# Altium schematic sheet sb-sonata-fpganaalog.SchDoc: FPGA Analog + 1.8V Bank
size Letter; Organization: NewAE Technology Inc.; Address1: 1083 Queen St., Suite 196; Address2: Halifax; Address3: NS; Address4: Canada B3H 0B2; SheetNumber: 15; SheetTotal: 19; SheetApproved: NO
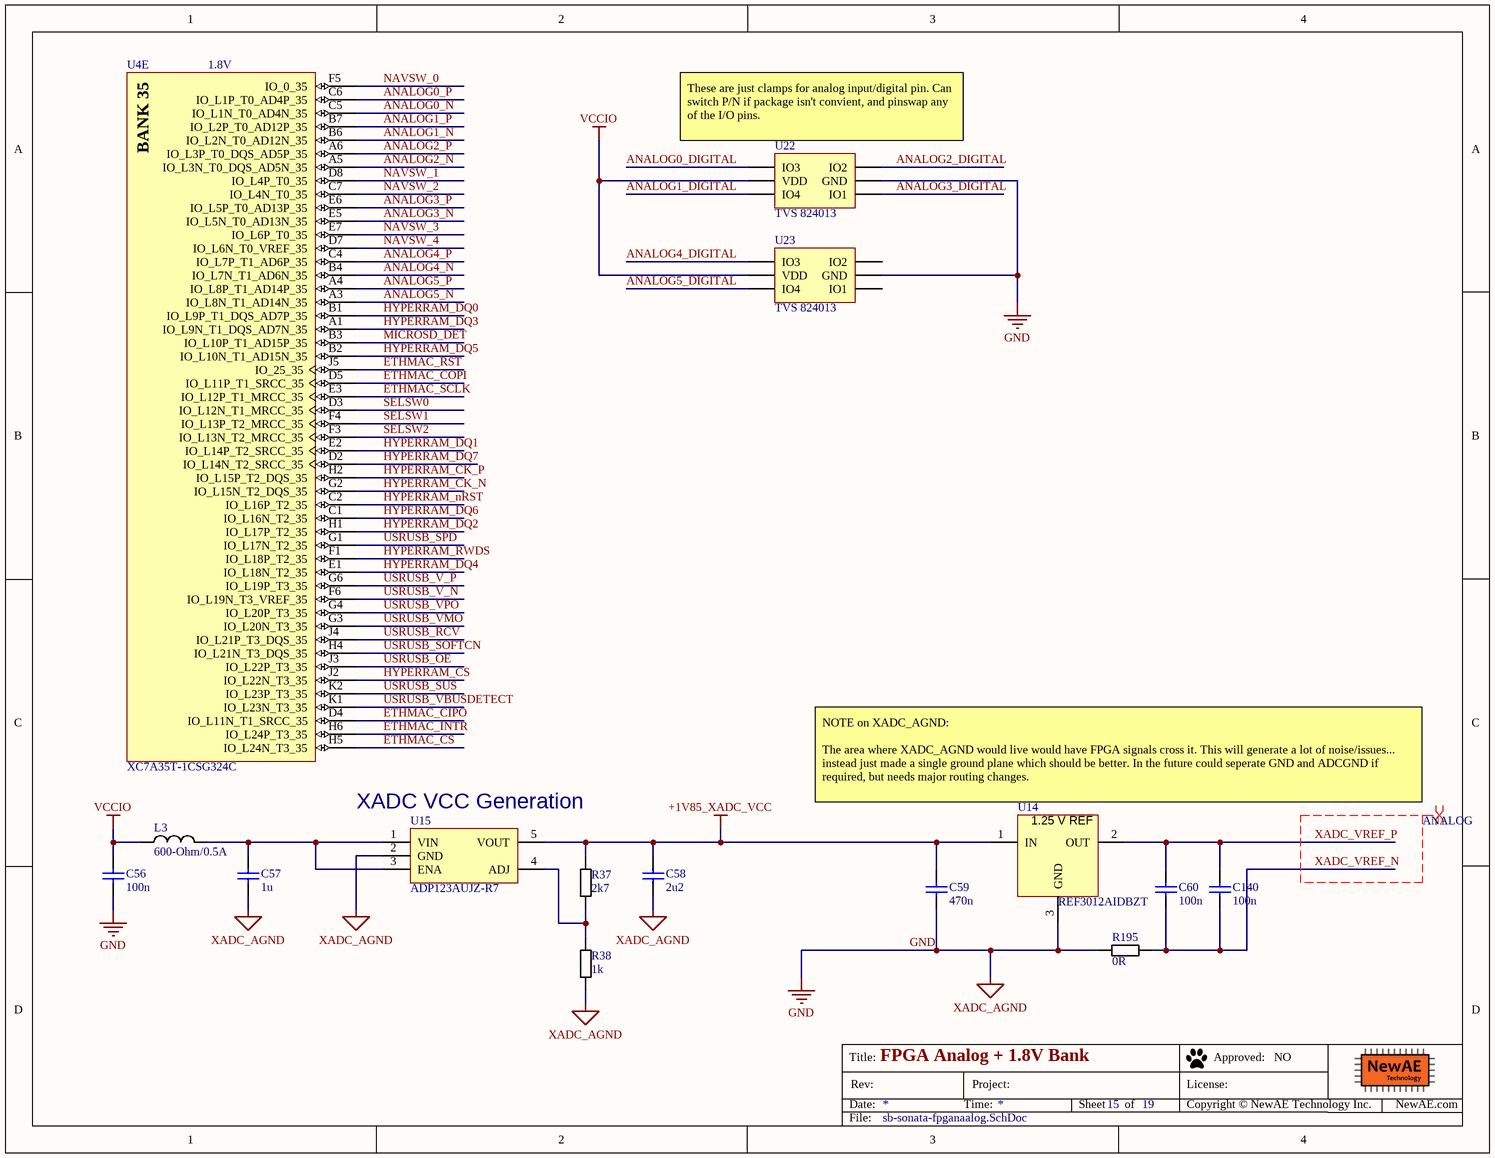
[diagram p0: sb-sonata-fpganaalog.SchDoc]

## Parts
C56  100n  [CAPC0402_M]
C57  1u  [CAPC0603_M]
C58  2u2  [CAPC0603_M]
C59  470n  [CAPC0603_M]
C60  100n  [CAPC0402_M]
C140  100n  [CAPC0402_M]
L3  600-Ohm/0.5A  [IND_0603]
R37  2k7  [RESC1005X40N]
R38  1k  [RESC1005X40N]
R195  0R  [RESC1005X40N]
U4  XC7A35T-1CSG324C  [CSG324]  (part E of 9)
U14  REF3012AIDBZT  [SOT95P237X112-3N]
U15  Linear Voltage Regulator IC  1 Output  300mA TSOT-5  [SOT23-5P95_285X145L45X40]  (value not drawn)
U22  TVS 824013  [SOT95P280X145-6N]
U23  TVS 824013  [SOT95P280X145-6N]

## Nets
+1V85_XADC_VCC: C58.1 C59.1 R37.1 U14.1(IN) U15.5(VOUT)
GND: C56.2 C57.2 C58.2 C59.2 R38.2 R195.1 U14.3(GND) U15.2(GND) U22.2(GND) U23.2(GND)  [also labelled XADC_AGND]
VCCIO: C56.1 L3.1 U22.5(VDD) U23.5(VDD)
ANALOG0_DIGITAL: U22.4(IO3)
ANALOG0_N: U4.C5(IO_L1N_T0_AD4N_35)
ANALOG0_P: U4.C6(IO_L1P_T0_AD4P_35)
ANALOG1_DIGITAL: U22.6(IO4)
ANALOG1_N: U4.B6(IO_L2N_T0_AD12N_35)
ANALOG1_P: U4.B7(IO_L2P_T0_AD12P_35)
ANALOG2_DIGITAL: U22.3(IO2)
ANALOG2_N: U4.A5(IO_L3N_T0_DQS_AD5N_35)
ANALOG2_P: U4.A6(IO_L3P_T0_DQS_AD5P_35)
ANALOG3_DIGITAL: U22.1(IO1)
ANALOG3_N: U4.E5(IO_L5N_T0_AD13N_35)
ANALOG3_P: U4.E6(IO_L5P_T0_AD13P_35)
ANALOG4_DIGITAL: U23.4(IO3)
ANALOG4_N: U4.B4(IO_L7N_T1_AD6N_35)
ANALOG4_P: U4.C4(IO_L7P_T1_AD6P_35)
ANALOG5_DIGITAL: U23.6(IO4)
ANALOG5_N: U4.A3(IO_L8N_T1_AD14N_35)
ANALOG5_P: U4.A4(IO_L8P_T1_AD14P_35)
ETHMAC_CIPO: U4.D4(IO_L11N_T1_SRCC_35)
ETHMAC_COPI: U4.D5(IO_L11P_T1_SRCC_35)
ETHMAC_CS: U4.H5(IO_L24N_T3_35)
ETHMAC_INTR: U4.H6(IO_L24P_T3_35)
ETHMAC_RST: U4.J5(IO_25_35)
ETHMAC_SCLK: U4.E3(IO_L12P_T1_MRCC_35)
HYPERRAM_CK_N: U4.G2(IO_L15N_T2_DQS_35)
HYPERRAM_CK_P: U4.H2(IO_L15P_T2_DQS_35)
HYPERRAM_CS: U4.J2(IO_L22N_T3_35)
HYPERRAM_DQ0: U4.B1(IO_L9P_T1_DQS_AD7P_35)
HYPERRAM_DQ1: U4.E2(IO_L14P_T2_SRCC_35)
HYPERRAM_DQ2: U4.H1(IO_L17P_T2_35)
HYPERRAM_DQ3: U4.A1(IO_L9N_T1_DQS_AD7N_35)
HYPERRAM_DQ4: U4.E1(IO_L18N_T2_35)
HYPERRAM_DQ5: U4.B2(IO_L10N_T1_AD15N_35)
HYPERRAM_DQ6: U4.C1(IO_L16N_T2_35)
HYPERRAM_DQ7: U4.D2(IO_L14N_T2_SRCC_35)
HYPERRAM_nRST: U4.C2(IO_L16P_T2_35)
HYPERRAM_RWDS: U4.F1(IO_L18P_T2_35)
MICROSD_DET: U4.B3(IO_L10P_T1_AD15P_35)
NAVSW_0: U4.F5(IO_0_35)
NAVSW_1: U4.D8(IO_L4P_T0_35)
NAVSW_2: U4.C7(IO_L4N_T0_35)
NAVSW_3: U4.E7(IO_L6P_T0_35)
NAVSW_4: U4.D7(IO_L6N_T0_VREF_35)
SELSW0: U4.D3(IO_L12N_T1_MRCC_35)
SELSW1: U4.F4(IO_L13P_T2_MRCC_35)
SELSW2: U4.F3(IO_L13N_T2_MRCC_35)
USRUSB_OE: U4.J3(IO_L22P_T3_35)
USRUSB_RCV: U4.J4(IO_L21P_T3_DQS_35)
USRUSB_SOFTCN: U4.H4(IO_L21N_T3_DQS_35)
USRUSB_SPD: U4.G1(IO_L17N_T2_35)
USRUSB_SUS: U4.K2(IO_L23P_T3_35)
USRUSB_V_N: U4.F6(IO_L19N_T3_VREF_35)
USRUSB_V_P: U4.G6(IO_L19P_T3_35)
USRUSB_VBUSDETECT: U4.K1(IO_L23N_T3_35)
USRUSB_VMO: U4.G3(IO_L20N_T3_35)
USRUSB_VPO: U4.G4(IO_L20P_T3_35)
XADC_VREF_N: C60.2 C140.2 R195.2
XADC_VREF_P: C60.1 C140.1 U14.2(OUT)
NetC57_1: C57.1 L3.2 U15.1(VIN) U15.3(ENA)
NetR37_2: R37.2 R38.1 U15.4(ADJ)

Not connected (* = marked no-connect by the designer): U23 1(IO1) 3(IO2)

## Layout directives
differential pair; differential pair class ANALOG: XADC_VREF_N, XADC_VREF_P

## Notes on the sheet
- 1.8V
- (near U22) These are just clamps for analog input/digital pin. Can switch P/N if package isn't convient, and pinswap any of the I/O pins.
- (near U15) XADC VCC Generation
- (near U14) NOTE on XADC_AGND:
  The area where XADC_AGND would live would have FPGA signals cross it. This will generate a lot of noise/issues... instead just made a single ground plane which should be better. In the future could seperate GND and ADCGND if required, but needs major routing changes.
- Title:
- Date:
- Rev:
- Time:
- Project:
- Sheet
- of
- License:
- Copyright © NewAE Technology Inc.
- Approved:
- NewAE.com
- File:
- (in symbol CMP-0383-00012-1, part E) BANK 35
- (in symbol REF3012AIDBZT) 1.25 V REF

## Library data of the parts
C56 C60 C140 = CCHIP-100n-0402: 100n, 0402; Manufacture Part Number 1: CGA2B3X7R1V104K050BB; Component Group: Capacitor; Case-EIA: 0402; Part Number: CCHIP-100n-0402; Footprint: 0402; Pin Count: 2; Value: 100n; Mounting Technology: SMT; Component Kind: Standard; Component Type: Standard; Supplier 1: Digi-Key; Supplier Part Number 1: 445-6901-1-ND
C57 = CCHIP-1u-0603: 1u, 0603, 50V; Manufacture Part Number 1: CL10A105KB8NNNC; Component Group: Capacitor; Case-EIA: 0603; Case-Metric: 1608; Rated Voltage: 50VDC; Part Number: CCHIP-1u-0603; Footprint: 0603; Pin Count: 2; Supplier 1: Digi-Key; Supplier Part Number 1: 1276-1860-1-ND; Value: 1u; Mounting Technology: SMT; Component Kind: Standard; Component Type: Standard
C58 = CCHIP-2u2-0603-25V: 2u2, 0603; Manufacture 1: Murata Electronics North America; Manufacture Part Number 1: GRM188R61E225MA12D; Component Group: Capacitor; Case-EIA: 0603; Case-Metric: 1608; Rated Voltage: 25VDC; Tolerance: ±20%; Part Number: CCHIP-2u2-0603-25V; Footprint: 0603; Pin Count: 2; Supplier 1: Digi-Key; Supplier Part Number 1: 490-12738-1-ND; Value: 2u2; Mounting Technology: SMT; RoHS: Yes; Component Kind: Standard; Component Type: Standard
C59 = CCHIP-470n-0603-50V: 470n, 0603, 50V; Manufacture 1: Taiyo Yuden; Manufacture Part Number 1: UMK107B7474KA-TR; Component Group: Capacitor; Case-EIA: 0603; Rated Voltage: 50VDC; Part Number: CCHIP-470n-0603-50V; Footprint: 0603; Pin Count: 2; Supplier 1: Digi-Key; Supplier Part Number 1: 587-3170-1-ND; Value: 470n; Mounting Technology: SMT; RoHS: Yes; Temperature Range: -55C to 125C; Component Kind: Standard; Component Type: Standard
L3 = FBCHIP-600R-0603: 600 Ohm @ 100 MHz, 0.5A rated FB; Manufacture 1: Murata Electronics; Manufacture Part Number 1: BLM18AG601SN1D; Component Group: Inductor; Value: 600R/0.5A; Case-EIA: 0603; Case-Metric: 1608; PP Material Stack: 0; Part Number: FBCHIP-600R-0603; Footprint: 0603; Pin Count: 2; Supplier 1: Digi-Key; Supplier Part Number 1: 490-1014-2-ND; Rated Power: 0.5A; Component Kind: Standard; Component Type: Standard; PP Rotation: 0
R37 = RCHIP-2K7-0402: 2k7 res, 0402, 1%, 1/16W; Manufacture 1: Yageo; Manufacture Part Number 1: RC0402FR-072K7L; Component Group: Resistor; Case-EIA: 0402; Case-Metric: 1005; Rated Power: 0.063W; Rated Voltage: 75VDC; Part Number: RCHIP-2K7-0402; Footprint: 0402; Pin Count: 2; Supplier 1: Digi-Key; Supplier Part Number 1: 311-2.70KLRCT-ND; Value: 2k7; Tolerance: 1%; Mounting Technology: SMT; Temperature Range: -55C to 155C; Component Kind: Standard; Component Type: Standard
R38 = RCHIP-1K-0402: 1k res, 0402, 1%, 1/16W; Manufacture 1: Yageo; Manufacture Part Number 1: RC0402FR-071KL; Component Group: Resistor; Case-EIA: 0402; Case-Metric: 1005; Rated Power: 0.063W; Rated Voltage: 75VDC; Part Number: RCHIP-1K-0402; Footprint: 0402; Pin Count: 2; Supplier 1: Digi-Key; Supplier Part Number 1: 311-1.00KLRCT-ND; Value: 1k; Tolerance: 1%; Mounting Technology: SMT; Temperature Range: -55C to 155C; Component Kind: Standard; Component Type: Standard
R195 = RCHIP-0R-0402: 2 ohm; Manufacture 1: Yageo; Manufacture Part Number 1: RC0402FR-070RL; Component Group: Resistor; Case-EIA: 0402; Case-Metric: 1005; Part Number: RCHIP-0R-0402; Footprint: 0402; Pin Count: 2; Supplier 1: Digi-Key; Supplier Part Number 1: 311-0.0LRCT-ND; Value: 0R; Component Kind: Standard; Component Type: Standard
U4 = CMP-0383-00012-1: Artix-7 FPGA, 210 User I/Os, 0 GTP, 324-Ball BGA, Speed Grade 1, Commercial Grade, Pb-Free; Manufacturer: Xilinx; GTP: 0; Available User I/O: 210; Speed Grades: 1; Logic Cells: 33280; Total Block RAM: 1800 Kb; CMTs: 5; Maximum Distributed RAM: 400 Kb; ComponentLink2URL: http://www.xilinx.com/support/documentation/data_sheets/ds180_7Series_Overview.pdf; ComponentLink2Description: Datasheet; DatasheetVersion: Rev. 1.15; PackageDescription: 324-Ball Wire-Bond Chip-Scale BGA, Body 15 x 15 mm, Pitch 0.8 mm; ComponentLink4URL: http://www.xilinx.com/support/documentation/user_guides/ug475_7Series_Pkg_Pinout.pdf; PackageReference: CSG-324; Mounting Technology: Surface Mount; PackageVersion: Rev. 1.11; ComponentLink1Description: Manufacturer URL; ComponentLink3Description: Pinout; ComponentLink1URL: http://www.xilinx.com/; ComponentLink3URL: http://www.xilinx.com/support/documentation/user_guides/ug475_7Series_Pkg_Pinout.pdf; PartNumber: XC7A35T-1CSG324C; ComponentLink4Description: Package Specification; Operating Temperature Range: Commercial
U14 = REF3012AIDBZT: IC VREF SERIES 0.2% SOT23-3; Manufacture 1: Texas Instruments; Output Voltage: 1.25V; Max Input Voltage: 5.5V; Max Output Current: 25mA; Min Input Voltage: 1.8V; Nominal Supply Current: 42uA; Temperature Coefficient: 50ppm/°C; Number of Channels: 1; Quiescent Current: 50uA; Min Output Voltage: 1.248V; Reference Type: Series,Fixed; Component Group: Analog IC; PP Material Stack: 0; Supplier 1: Digi-Key; RoHS: Yes; Category: Voltage References; Stock 1: 7831; Pricing 1: 1=1.18000, 10=1.05300, 25=0.99960, 100=0.76760 (USD); Case/Package: SOT-23; Number of Pins: 3; Min Operating Temperature: -40°C; Max Operating Temperature: 125°C; Packaging: Tape and Reel; Package Quantity: 1; Output Current: 25mA; Max Supply Current: 50uA; Max Output Voltage: 1.25V; Reference Voltage: 1.25V; Termination: SMD/SMT; Length: 2.92mm; Width: 1.3mm; Height: 1mm; Radiation Hardening: No; REACH SVHC: No SVHC; Lead Free: Lead Free; ComponentLink3URL: https://datasheet.ciiva.com/2007/ref3012-2007154.pdf?src-supplier=Digi-Key; ComponentLink3Description: https://datasheet.ciiva.com/2007/ref3012-2007154.pdf?src-supplier=Digi-Key; ComponentLink4URL: https://datasheet.ciiva.com/2007/ref3012-2007155.pdf?src-supplier=Digi-Key; ComponentLink4Description: https://datasheet.ciiva.com/2007/ref3012-2007155.pdf?src-supplier=Digi-Key; ComponentLink5URL: https://datasheet.ciiva.com/3235/ref3033-3235533.pdf?src-supplier=Avnet; ComponentLink5Description: https://datasheet.ciiva.com/3235/ref3033-3235533.pdf?src-supplier=Avnet; ComponentLink6URL: https://datasheet.ciiva.com/3235/ref3033-3235534.pdf?src-supplier=Avnet; ComponentLink6Description: https://datasheet.ciiva.com/3235/ref3033-3235534.pdf?src-supplier=Avnet; .Checked SCH: *; .Checked PCB: *; Supplier Part Number 1: REF3012AIDBZTTR-ND; Manufacturer Part Number: REF3012AIDBZT; Part Number: REF3012AIDBZT; Footprint: SOT23-3; Manufacture Part Number 1: REF3012AIDBZT; Pin Count: 3; Mounting Technology: SMT; Component Kind: Standard; Component Type: Standard; PP Rotation: 0
U15 = ADP123AUJZ-R7: IC REG LIN POS ADJ 300MA TSOT5; Manufacture 1: Analog Devices Inc.; Dropout Voltage: 85mV; Output Voltage: 5V; Number of Outputs: 1; Max Input Voltage: 5.5V; Min Input Voltage: 2.3V; Min Current Limit: 350mA; Polarity: Positive; Quiescent Current: 45uA; Reference Voltage: 500mV; Min Output Voltage: 800mV; Accuracy: 1%; Power Supply Rejection Ratio (PSRR): 60dB; Max Supply Current: 170uA; Output Type: Adjustable; Component Group: Analog IC; PP Material Stack: 0; Supplier 1: Digi-Key; Category: Voltage Regulators - Linear; Stock 1: 14167; Pricing 1: 1=1.16000, 10=1.03300, 25=0.98000, 100=0.75250, 250=0.66500, 500=0.63000, 1000=0.49000 (USD); Case/Package: TSOT; Number of Pins: 5; Contact Plating: Tin,Matte; Min Operating Temperature: -40°C; Max Operating Temperature: 125°C; Output Current: 300mA; Max Output Current: 300mA; Packaging: Tape and Reel; Number of Regulators: 1; Max Output Voltage: 5V; Output Voltage Accuracy: 1%; Nominal Supply Current: 45uA; Operating Supply Current: 45uA; Length: 2.9mm; Width: 1.6mm; Height: 0.9mm; REACH SVHC: No SVHC; Lead Free: Contains Lead; ComponentLink3URL: https://datasheet.ciiva.com/2040/adp122-123-2040698.pdf?src-supplier=Digi-Key; ComponentLink3Description: https://datasheet.ciiva.com/2040/adp122-123-2040698.pdf?src-supplier=Digi-Key; ComponentLink4URL: https://datasheet.ciiva.com/2040/adp122-123-2040699.pdf?src-supplier=Digi-Key; ComponentLink4Description: https://datasheet.ciiva.com/2040/adp122-123-2040699.pdf?src-supplier=Digi-Key; Supplier Part Number 1: ADP123AUJZ-R7TR-ND; .Checked SCH: *; .Checked PCB: *; Manufacturer Part Number: ADP123AUJZ-R7; Part Number: ADP123AUJZ-R7; Manufacture Part Number 1: ADP123AUJZ-R7; Pin Count: 5; Mounting Technology: SMT; Component Kind: Standard; Component Type: Standard; PP Rotation: 0; Footprint: SOT23-5
U22 U23 = TVS_4IO_3v3: TVS DIODE 3.3V 6V SOT23-6L; Manufacture 1: Wurth Electronics Inc.; Manufacture Part Number 1: 824013; Component Group: Analog IC; PP Material Stack: 0; Part Number: TVS_4IO_3v3; Footprint: SOT-23-6; Pin Count: 6; Supplier 1: Digi-Key; Supplier Part Number 1: 732-4466-1-ND; Mounting Technology: SMT; RoHS: Yes; Component Kind: Standard; Component Type: Standard; PP Rotation: 0